# EAGLE design CubeBoard (EAGLE 7.2.0)
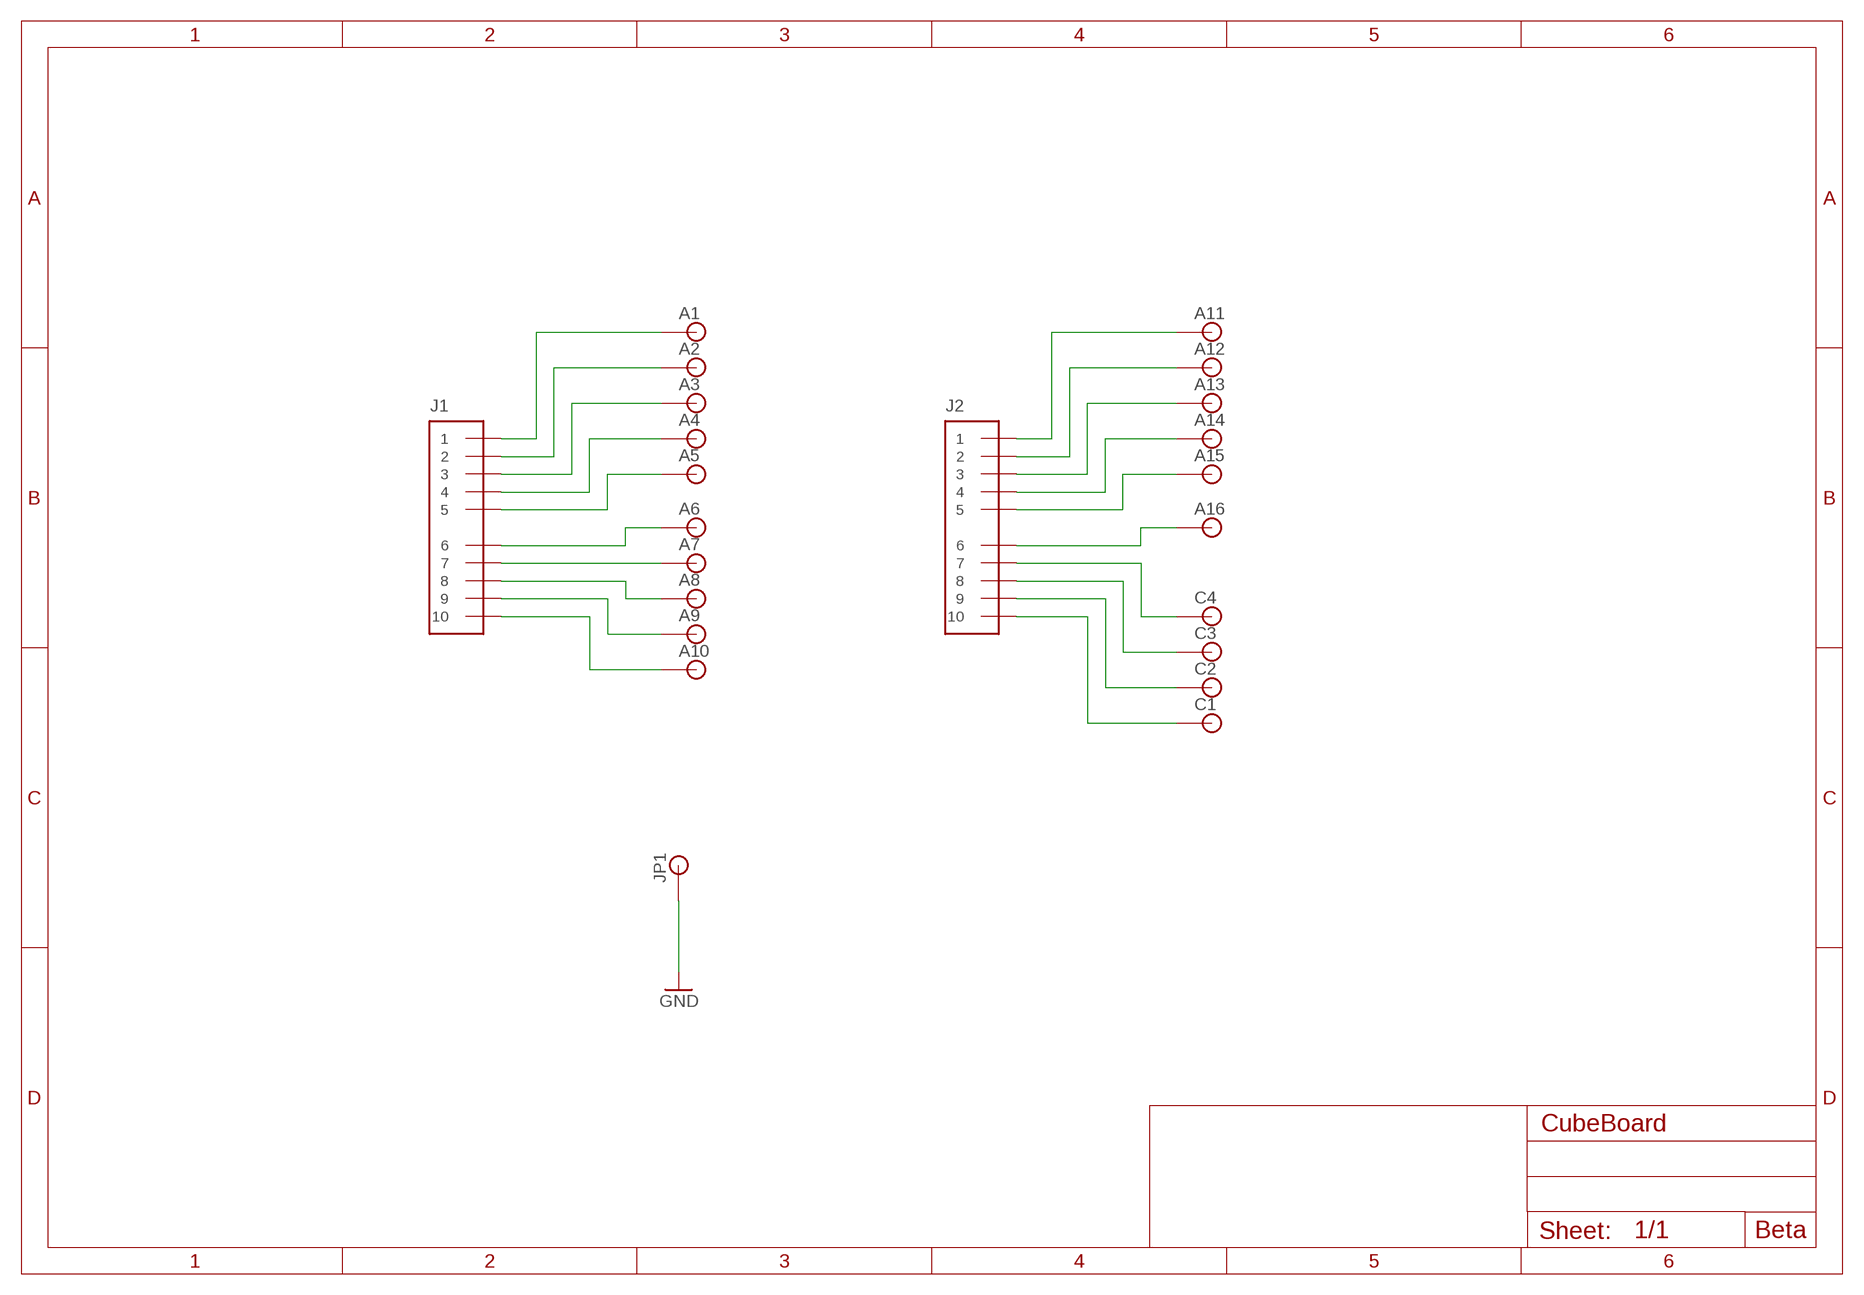
[diagram p0: schematic, sheet 1]

## Parts
A1  anode1  PIN-1X1  [PIN-1X1]
A2  anode2  PIN-1X1  [PIN-1X1]
A3  anode3  PIN-1X1  [PIN-1X1]
A4  anode4  PIN-1X1  [PIN-1X1]
A5  anode5  PIN-1X1  [PIN-1X1]
A6  anode6  PIN-1X1  [PIN-1X1]
A7  anode7  PIN-1X1  [PIN-1X1]
A8  anode8  PIN-1X1  [PIN-1X1]
A9  anode9  PIN-1X1  [PIN-1X1]
A10  anode10  PIN-1X1  [PIN-1X1]
A11  anode11  PIN-1X1  [PIN-1X1]
A12  anode12  PIN-1X1  [PIN-1X1]
A13  anode13  PIN-1X1  [PIN-1X1]
A14  anode14  PIN-1X1  [PIN-1X1]
A15  anode15  PIN-1X1  [PIN-1X1]
A16  anode16  PIN-1X1  [PIN-1X1]
C1  cathode1  PIN-1X1  [PIN-1X1]
C2  cathode2  PIN-1X1  [PIN-1X1]
C3  cathode3  PIN-1X1  [PIN-1X1]
C4  cathode4  PIN-1X1  [PIN-1X1]
J1  PINHEAD-1X10  [1X10-SNEAKY]
J2  PINHEAD-1X10  [1X10-SNEAKY]
JP1  PIN-1X1  [PIN-1X1]

## Nets
GND: JP1.1
N$1: A1.1 J1.1
N$2: A2.1 J1.2
N$3: A3.1 J1.3
N$4: A4.1 J1.4
N$5: A5.1 J1.5
N$6: A6.1 J1.6
N$7: A7.1 J1.7
N$8: A8.1 J1.8
N$9: A9.1 J1.9
N$10: A10.1 J1.10
N$11: A11.1 J2.1
N$12: A12.1 J2.2
N$13: A13.1 J2.3
N$14: A14.1 J2.4
N$15: A15.1 J2.5
N$16: A16.1 J2.6
N$17: C4.1 J2.7
N$18: C3.1 J2.8
N$19: C2.1 J2.9
N$20: C1.1 J2.10

## Notes on the sheet
- Beta

## Library data of the parts
A1-A16 C1-C4 JP1 = Gclue:PIN-1X1
J1 J2 = Gclue:PINHEAD-1X10

## Net classes
0 default: width 0.254 mm

## Board
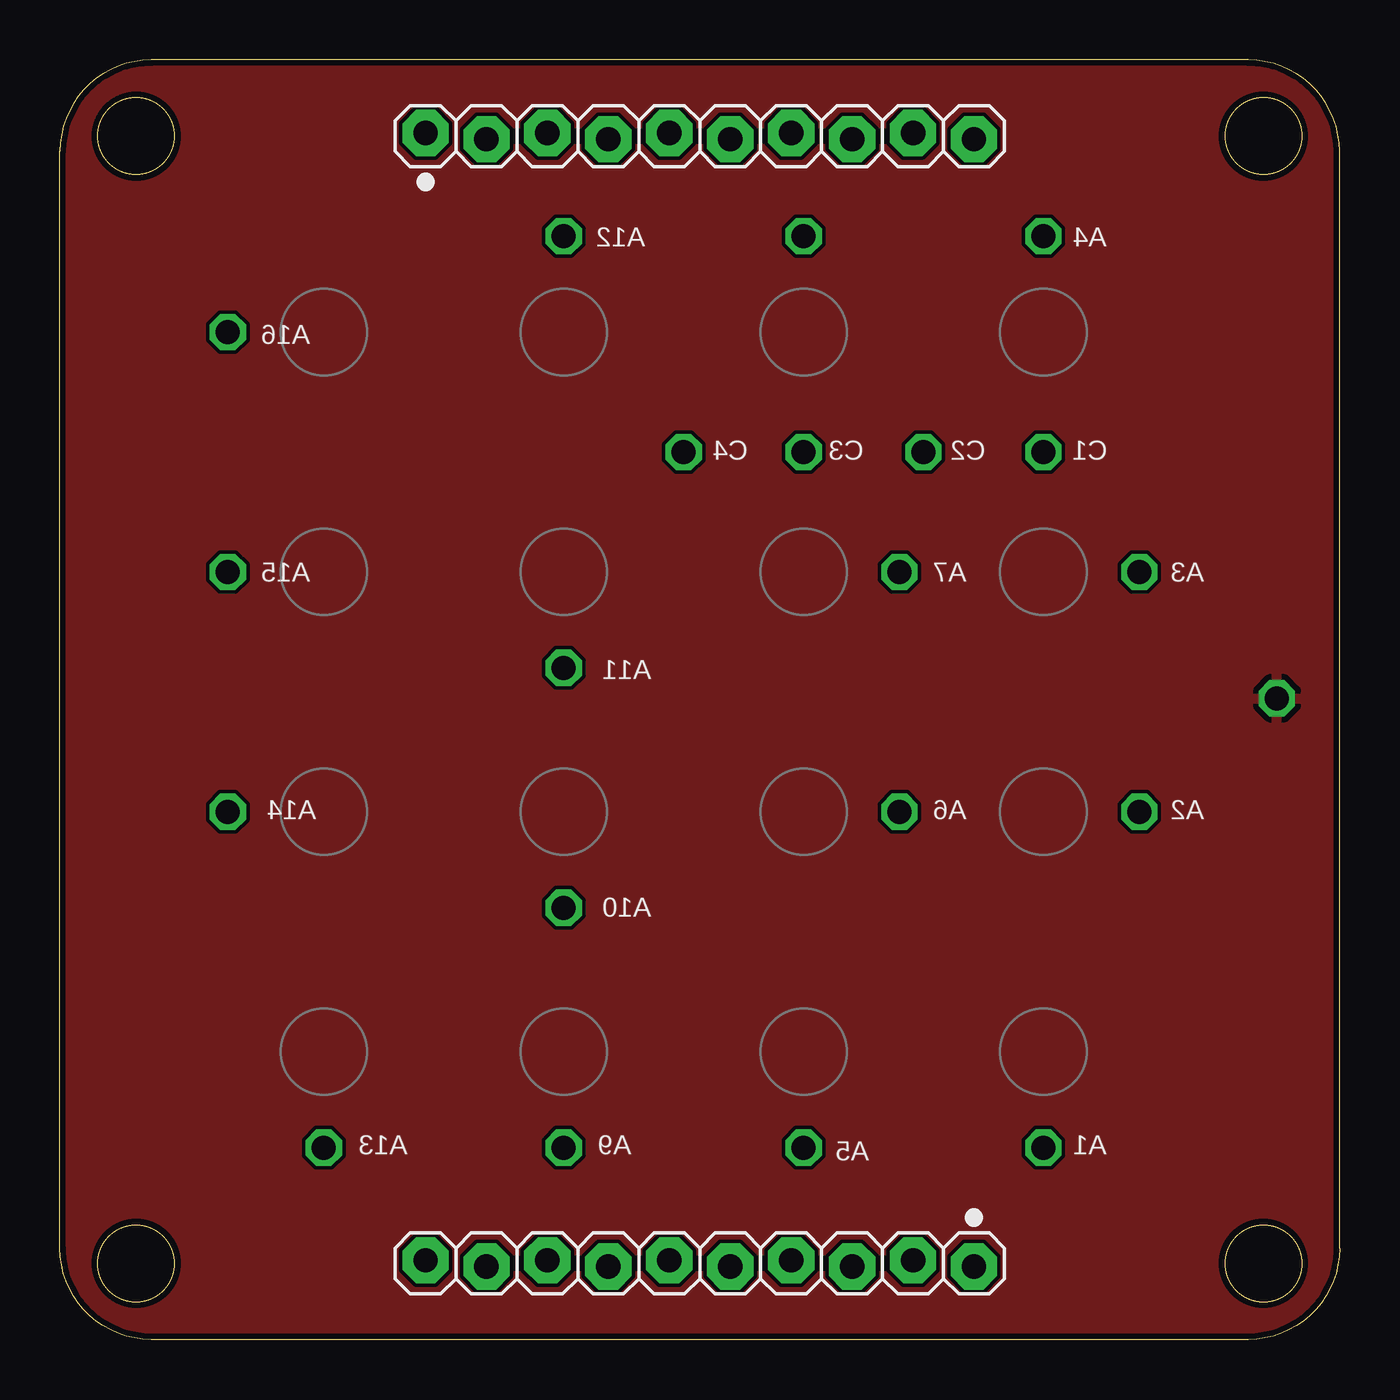
[diagram p1: board, top side]
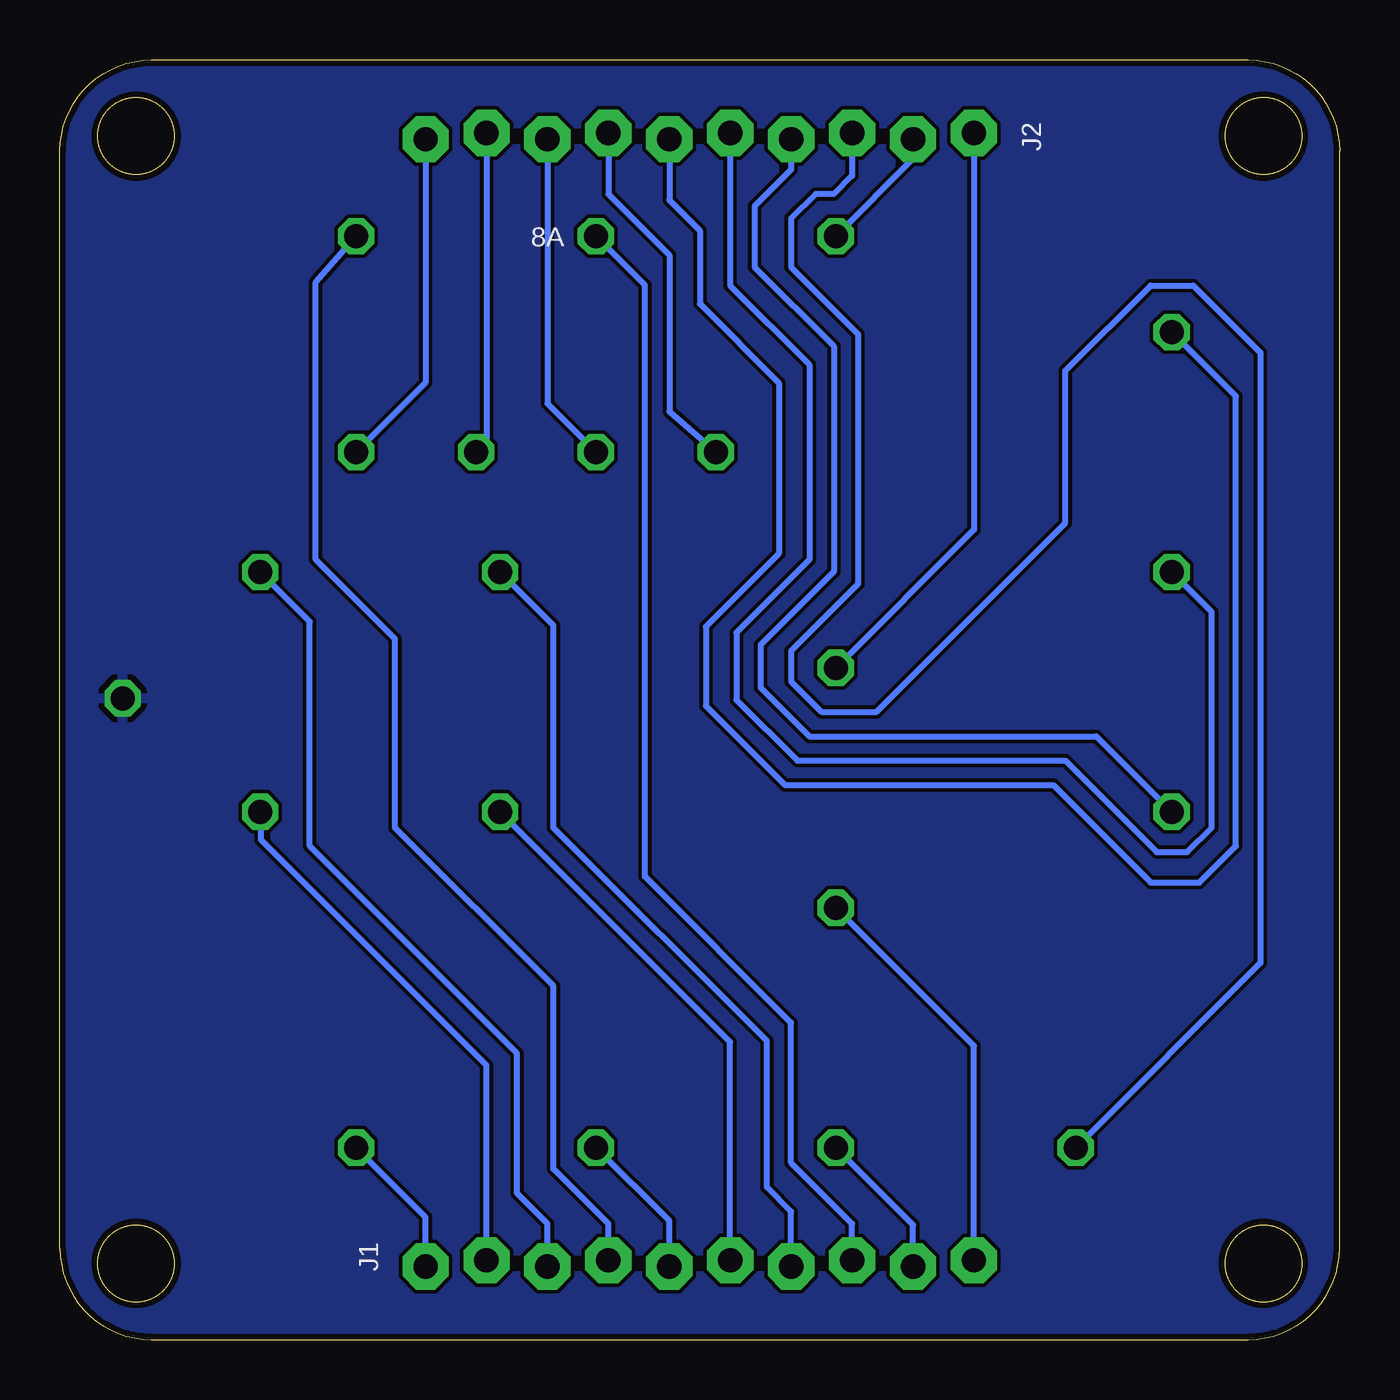
[diagram p2: board, bottom side, seen from below]

Size 53.34 x 53.34 mm. Coordinates in mm from the lower left corner, seen from the top.
Outline: 49.53,0 3.81,0 arc-90 0,3.81 0,49.53 arc-90 3.81,53.34 49.53,53.34 arc-90 53.34,49.53 53.34,3.81 arc-90 49.53,0
Outline: circle at 3.17,3.17 radius 1.6
Outline: circle at 3.17,50.16 radius 1.6
Outline: circle at 50.16,3.17 radius 1.6
Outline: circle at 50.16,50.16 radius 1.6
Copper layers (1*16): Top 0.035mm / dielectric 1.5mm / Bottom 0.035mm
Design rules "Elecrow_2-layer_eagle_rule": minimum track width 6mil, minimum drill 12mil, track to track 6mil, track to pad 6mil, pad to pad 6mil, via to via 6mil, smd to smd 0mil, copper to edge 10mil, drill to drill 10mil, minimum pad ring 10mil, minimum via ring 6mil, stop-mask expansion 2mil, vias tented up to drill 100mil, thermal gap 10mil

### Footprints (pad centres in the part's own frame; a part is rotated, then mirrored left to right if it is on the bottom)
PIN-1X1 = drill 1 octagon: 1 0,0
1X10-SNEAKY = drill 1.016 pad 1.93 octagon: 1 -11.43,0.127; 2 -8.89,-0.127; 3 -6.35,0.127; 4 -3.81,-0.127; 5 -1.27,0.127; 6 1.27,-0.127; 7 3.81,0.127; 8 6.35,-0.127; 9 8.89,0.127; 10 11.43,-0.127

### Placement (x,y rotation side)
A1  41,8 0 top
A2  45,22 0 top
A3  45,32 0 top
A4  41,46 0 top
A5  31,8 0 top
A6  35,22 0 top
A7  35,32 0 top
A8  31,46 0 top
A9  21,8 0 top
A10  21,18 0 top
A11  21,28 0 top
A12  21,46 0 top
A13  11,8 0 top
A14  7,22 0 top
A15  7,32 0 top
A16  7,42 0 top
C1  41,37 0 top
C2  36,37 0 top
C3  31,37 0 top
C4  26,37 0 top
J1  26.67,3.17 180 top
J2  26.67,50.16 0 top
JP1  50.73,26.73 0 top

### Tracks (layer width: path | path; a pad name or v marks a point on that pad's centre or on a via)
GND
  pour Bottom: -1.27,-1.27 54.61,-1.27 54.61,54.61 -1.27,54.61
  pour Top: -1.27,-1.27 54.61,-1.27 54.61,54.61 -1.27,54.61
N$1
  Bottom 0.254: J1.1 38.1,5.1 A1.1
N$2
  Bottom 0.254: J1.2 35.56,11.43 44.96,20.83 44.96,21.84 A2.1
N$3
  Bottom 0.254: J1.3 33.02,4.83 34.29,6.1 34.29,11.94 42.93,20.57 42.93,29.93 A3.1
N$4
  Bottom 0.254: J1.4 30.48,4.83 32.77,7.11 32.77,14.73 39.37,21.34 39.37,29.21 42.67,32.51 42.67,44.07 A4.1
N$5
  Bottom 0.254: J1.5 27.94,4.94 A5.1
N$6
  Bottom 0.254: J1.6 25.4,12.4 A6.1
N$7
  Bottom 0.254: J1.7 22.86,5.33 23.88,6.35 23.88,12.45 32.77,21.34 32.77,29.77 A7.1
N$8
  Bottom 0.254: J1.8 20.32,4.83 22.86,7.37 22.86,13.21 28.96,19.3 28.96,43.96 A8.1
N$9
  Bottom 0.254: J1.9 17.78,4.78 A9.1
N$10
  Bottom 0.254: J1.10 15.24,12.24 A10.1
N$11
  Bottom 0.254: J2.1 15.24,33.76 A11.1
N$12
  Bottom 0.254: J2.2 17.78,49.22 A12.1
N$13
  Bottom 0.254: J2.3 20.32,48.51 21.08,47.75 21.84,47.75 22.86,46.74 22.86,44.7 20.07,41.91 20.07,31.5 22.86,28.7 22.86,27.43 21.59,26.16 19.3,26.16 11.43,34.04 11.43,40.39 7.87,43.94 6.1,43.94 3.3,41.15 3.3,15.7 A13.1
N$14
  Bottom 0.254: J2.4 22.86,48.77 24.38,47.24 24.38,44.7 21.08,41.4 21.08,32 24.13,28.96 24.13,27.18 22.1,25.15 10.15,25.15 A14.1
N$15
  Bottom 0.254: J2.5 25.4,43.94 22.1,40.64 22.1,32.51 25.15,29.46 25.15,26.67 22.61,24.13 11.43,24.13 7.62,20.32 6.35,20.32 5.33,21.34 5.33,30.33 A15.1
N$16
  Bottom 0.254: J2.6 27.94,47.5 26.67,46.23 26.67,43.18 23.37,39.88 23.37,32.77 26.42,29.72 26.42,26.42 23.11,23.11 11.94,23.11 7.87,19.05 5.84,19.05 4.32,20.57 4.32,39.32 A16.1
N$17
  Bottom 0.254: J2.7 30.48,47.75 27.94,45.21 27.94,38.69 C4.1
N$18
  Bottom 0.254: J2.8 33.02,39.02 C3.1
N$19
  Bottom 0.254: J2.9 35.56,37.44 C2.1
N$20
  Bottom 0.254: J2.10 38.1,39.9 C1.1

### Text on the board
tPlace: A12 | A4 | A16 | C4 | C3 | C2 | C1 | A15 | A7 | A3 | A11 | A14 | A6 | A2 | A10 | A13 | A9 | A5 | A1
bPlace: A8